# EAGLE design tltest (EAGLE 5.12)
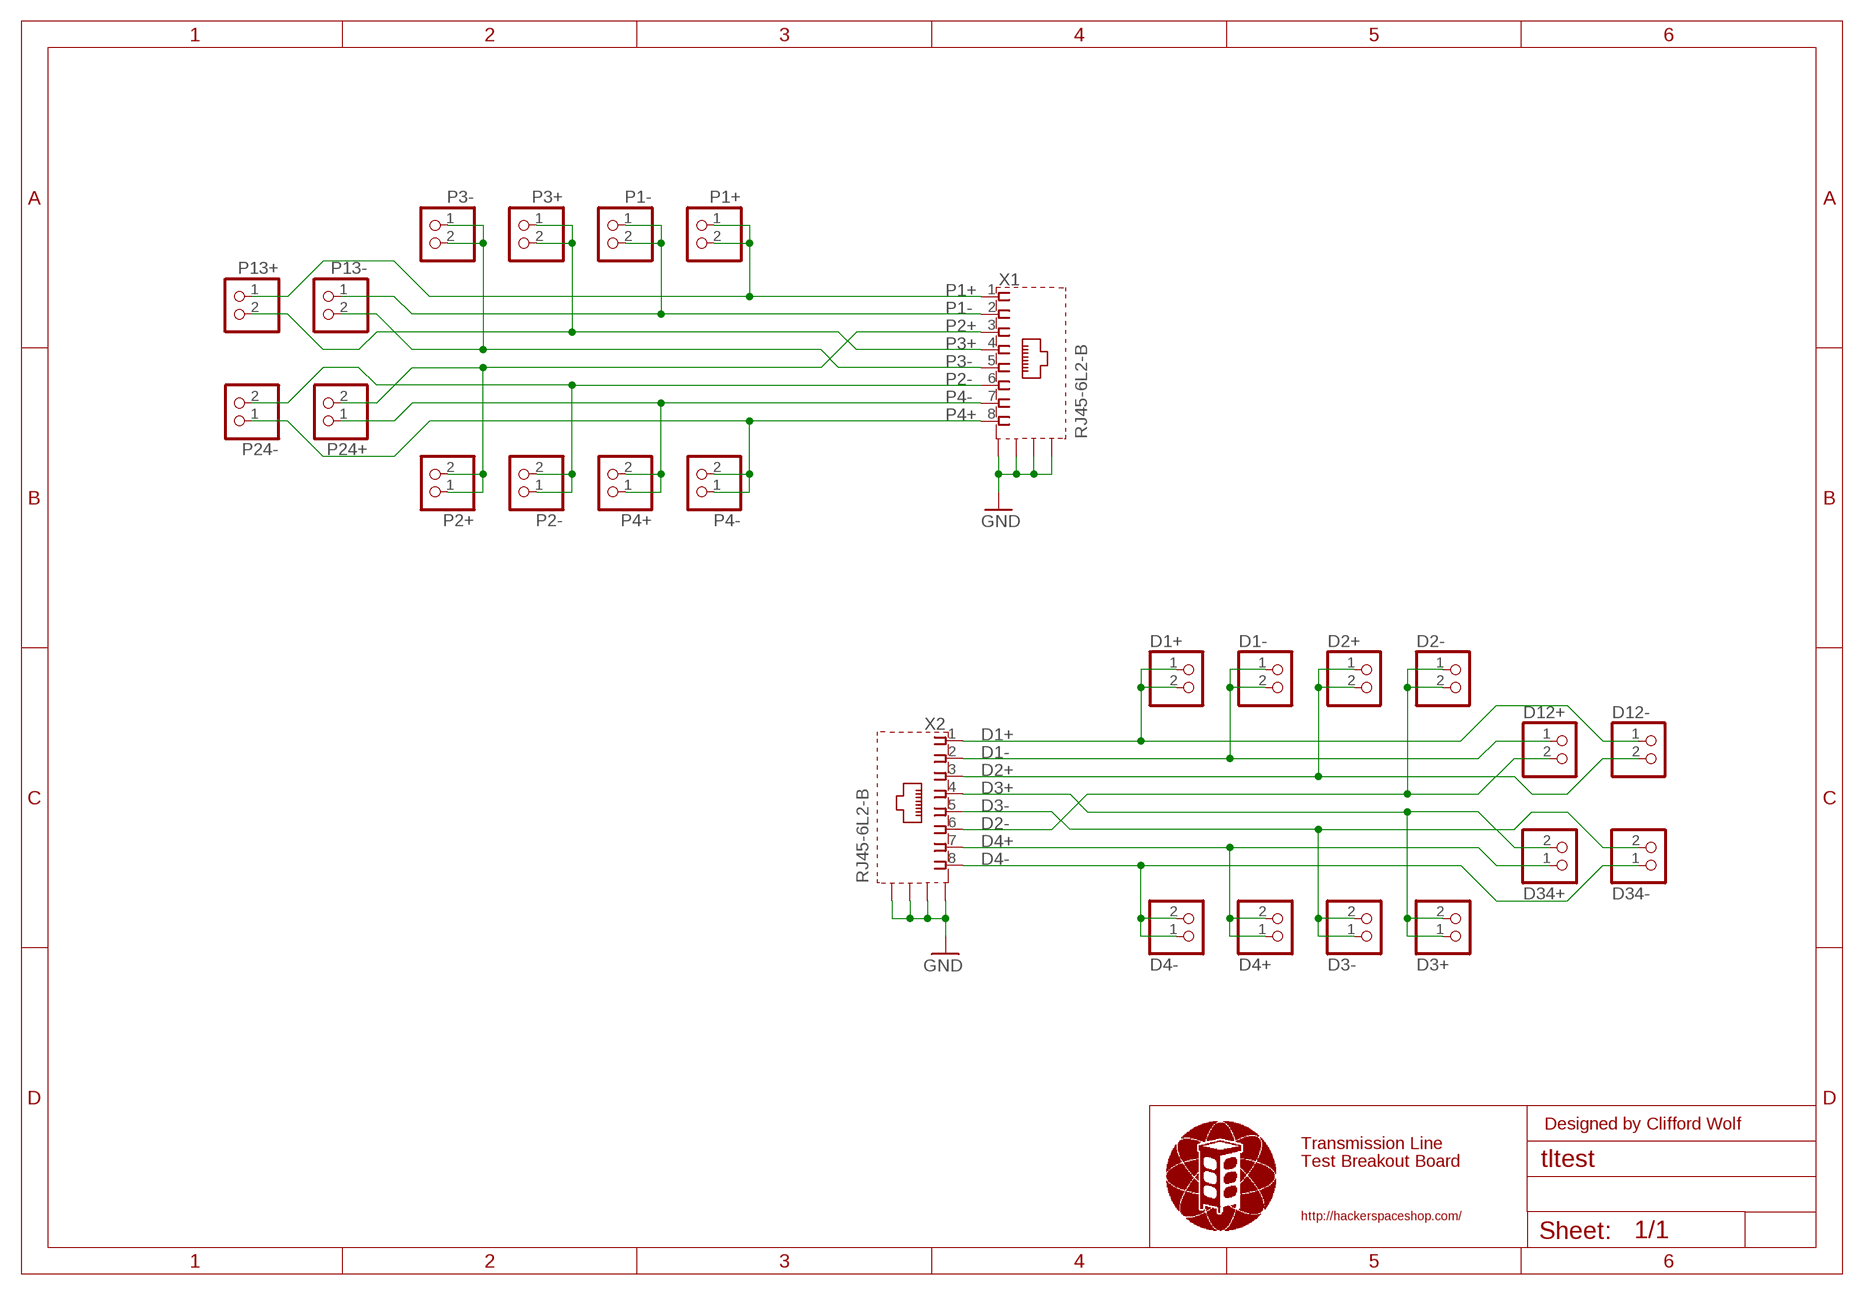
[diagram p0: schematic, sheet 1]

## Parts
D1+  PINHD-1X2  [1X02]
D1-  PINHD-1X2  [1X02]
D2+  PINHD-1X2  [1X02]
D2-  PINHD-1X2  [1X02]
D3+  PINHD-1X2  [1X02]
D3-  PINHD-1X2  [1X02]
D4+  PINHD-1X2  [1X02]
D4-  PINHD-1X2  [1X02]
D12+  PINHD-1X2  [1X02]
D12-  PINHD-1X2  [1X02]
D34+  PINHD-1X2  [1X02]
D34-  PINHD-1X2  [1X02]
P1+  PINHD-1X2  [1X02]
P1-  PINHD-1X2  [1X02]
P2+  PINHD-1X2  [1X02]
P2-  PINHD-1X2  [1X02]
P3+  PINHD-1X2  [1X02]
P3-  PINHD-1X2  [1X02]
P4+  PINHD-1X2  [1X02]
P4-  PINHD-1X2  [1X02]
P13+  PINHD-1X2  [1X02]
P13-  PINHD-1X2  [1X02]
P24+  PINHD-1X2  [1X02]
P24-  PINHD-1X2  [1X02]
X1  RJ45-6L2-B  [RJ45-SHIELD2]
X2  RJ45-6L2-B  [RJ45-SHIELD2]

## Nets
D1+: D1+.1 D1+.2 D12-.1 X2.1
D1-: D1-.1 D1-.2 D12+.1 X2.2
D2+: D2+.1 D2+.2 D12-.2 X2.3
D2-: D2-.1 D2-.2 D12+.2 X2.6
D3+: D3+.1 D3+.2 D34+.2 X2.4
D3-: D3-.1 D3-.2 D34-.2 X2.5
D4+: D4+.1 D4+.2 D34+.1 X2.7
D4-: D4-.1 D4-.2 D34-.1 X2.8
GND: X1.S1(S) X1.S2(S) X1.S3(S) X1.S4(S) X2.S1(S) X2.S2(S) X2.S3(S) X2.S4(S)
P1+: P1+.1 P1+.2 P13+.1 X1.1
P1-: P1-.1 P1-.2 P13-.1 X1.2
P2+: P2+.1 P2+.2 P24+.2 X1.3
P2-: P2-.1 P2-.2 P24-.2 X1.6
P3+: P3+.1 P3+.2 P13+.2 X1.4
P3-: P3-.1 P3-.2 P13-.2 X1.5
P4+: P4-.1 P4-.2 P24-.1 X1.8
P4-: P4+.1 P4+.2 P24+.1 X1.7

## Notes on the sheet
- Designed by Clifford Wolf
- Transmission Line
- Test Breakout Board
- http://hackerspaceshop.com/

## Library data of the parts
D1+ D1- D2+ D2- D3+ D3- D4+ D4- D12+ D12- D34+ D34- P1+ P1- P2+ P2- P3+ P3- P4+ P4- P13+ P13- P24+ P24- = mpc_pinhead:PINHD-1X2: PIN HEADER
X1 X2 = con-tycoelectronics:RJ45*2: RJ45 Low Profile Shield Type 2 For all RJ45 L, LC, LCT and X Series Models Source: www.tycoelectronics.com .. ENG_DS_1654001_1099_RJ_L_0507.pdf; MPN: RJ45-6L2-B; OC_FARNELL: unknown; OC_NEWARK: 16R6096

## Board
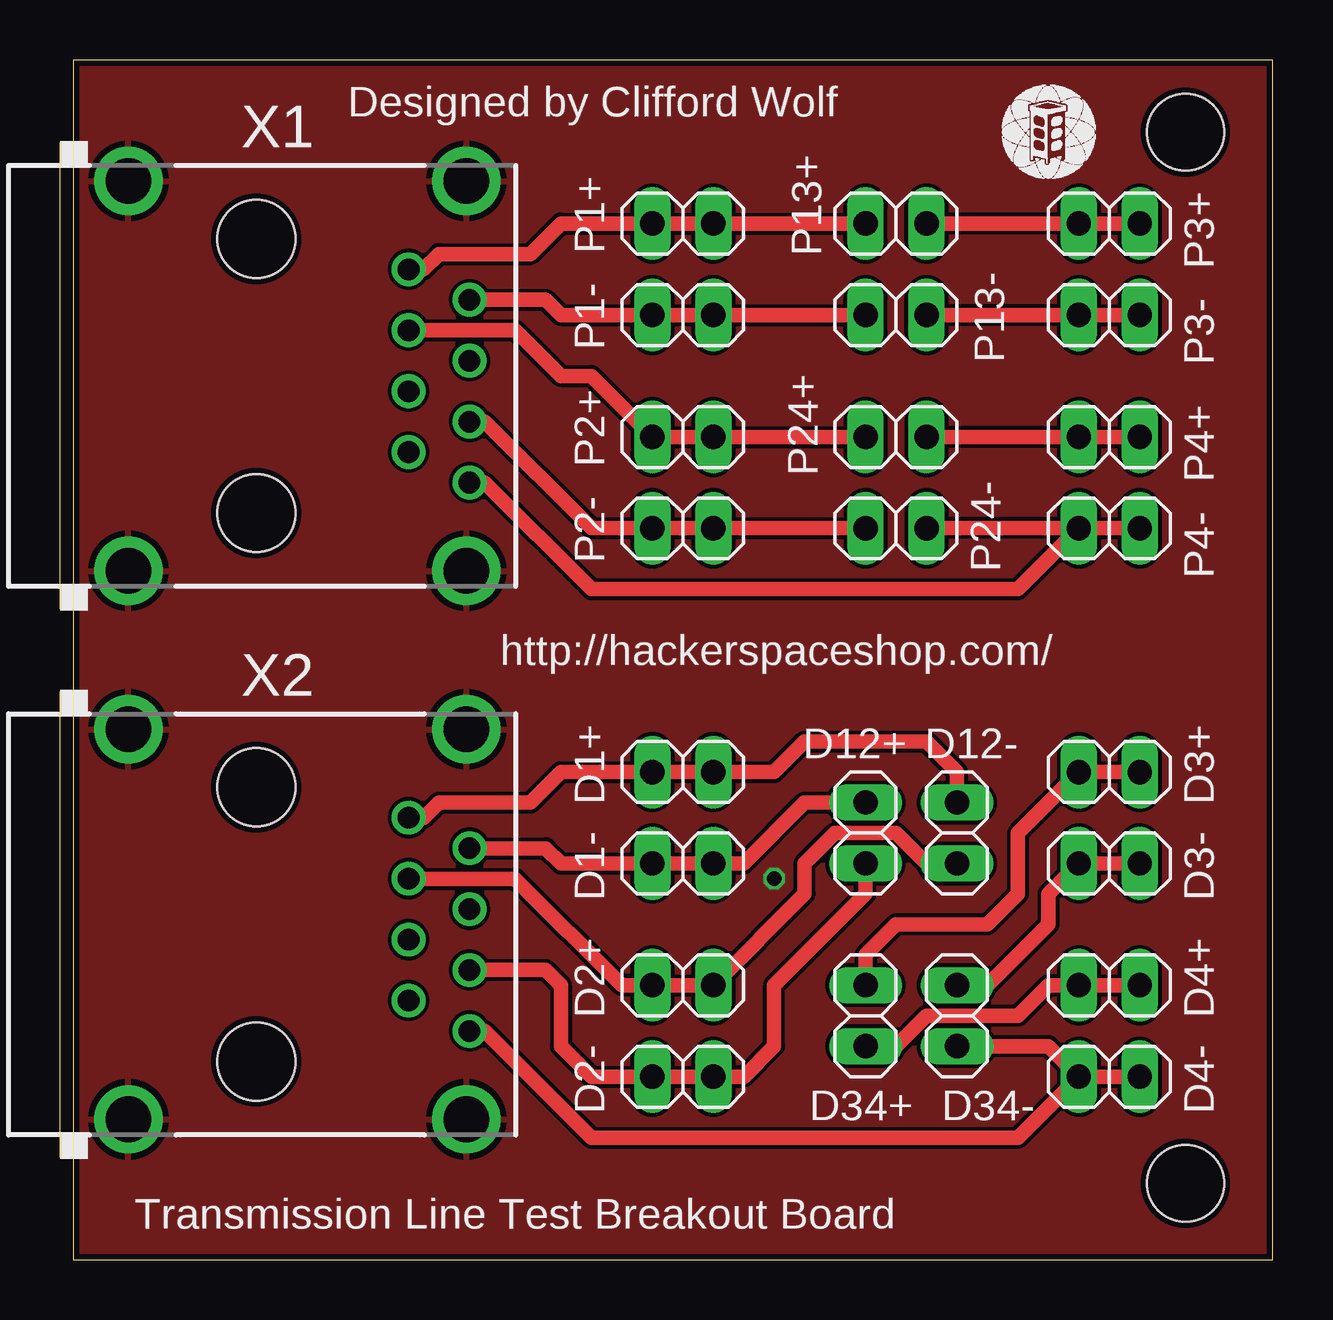
[diagram p1: board, top side]
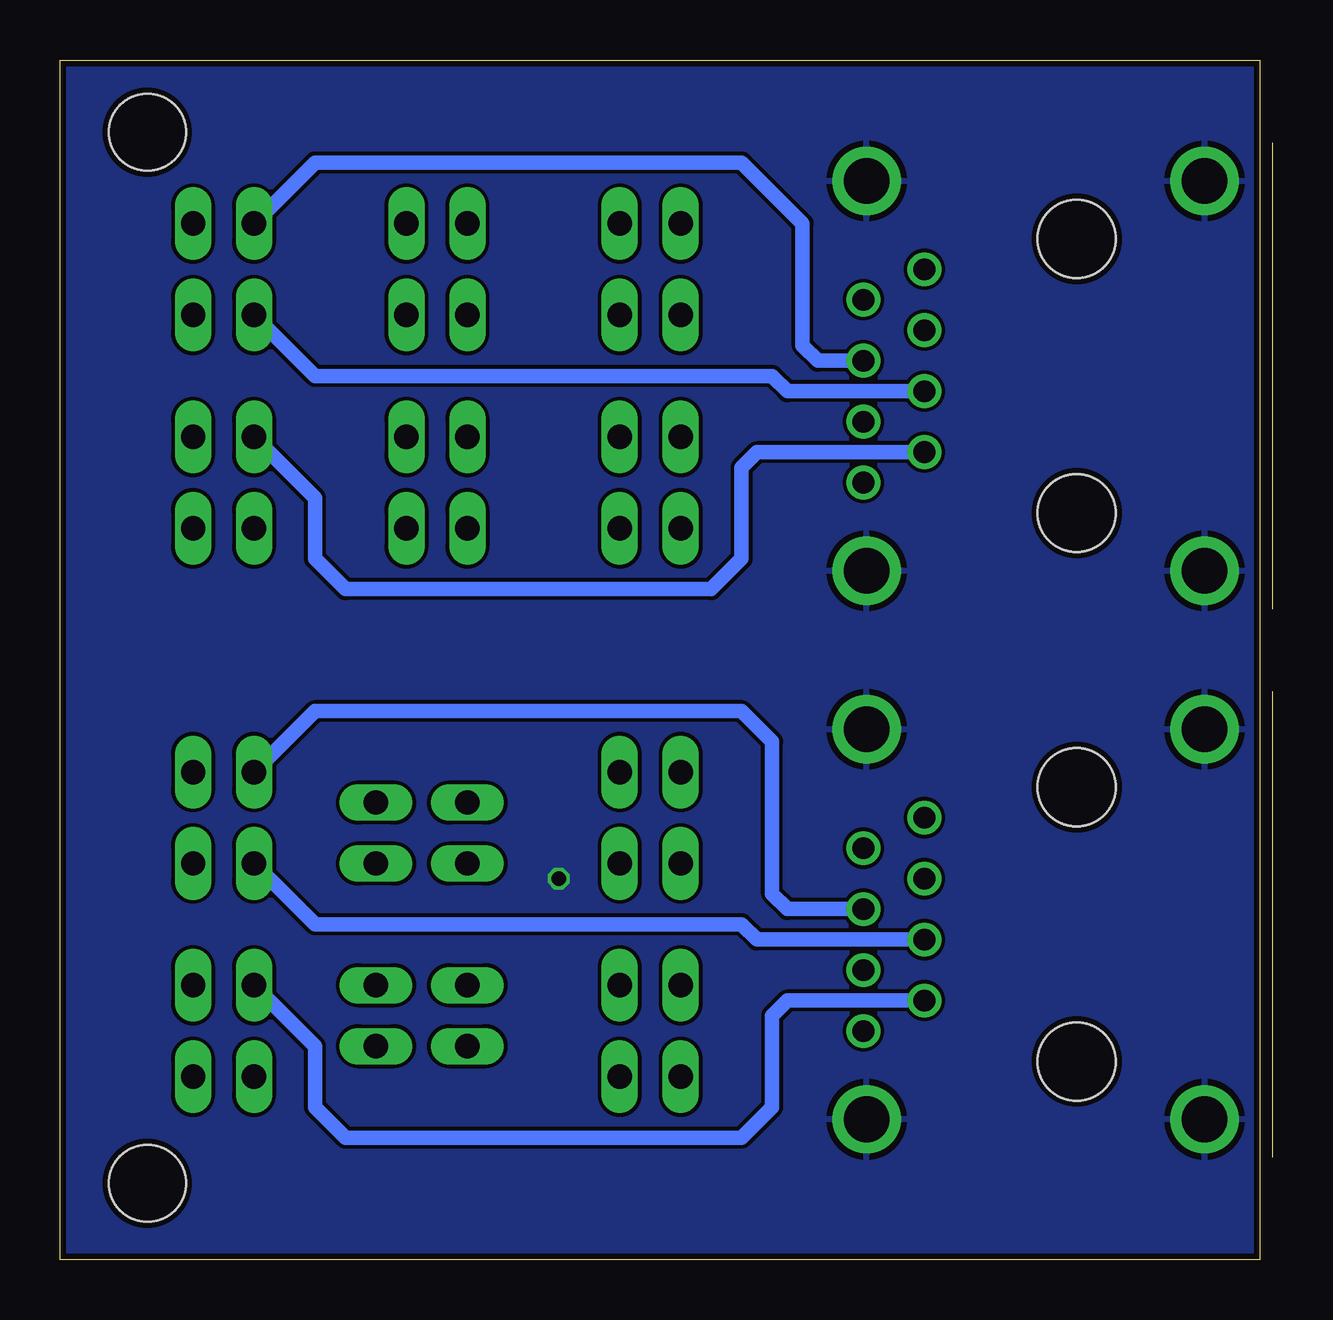
[diagram p2: board, bottom side, seen from below]

Size 50 x 50 mm. Coordinates in mm from the lower left corner, seen from the top.
Outline: 0,0 50,0 50,50 0,50 0,0
Copper layers (1*16): Top 0.035mm / dielectric 1.5mm / Bottom 0.035mm
Design rules "seeed": minimum track width 6mil, minimum drill 12mil, track to track 6mil, track to pad 6mil, pad to pad 6mil, via to via 6mil, smd to smd 0mil, copper to edge 10mil, drill to drill 10mil, minimum pad ring 10mil, minimum via ring 6mil, stop-mask expansion 2mil, vias tented up to drill 100mil, thermal gap 10mil
Holes 3.2 mm at 46.35,46.99 46.35,3.17

### Footprints (pad centres in the part's own frame; a part is rotated, then mirrored left to right if it is on the bottom)
1X02 = drill 1.016 long: 1 -1.27,0; 2 1.27,0
RJ45-SHIELD2 = drill 0.9 pad 1.4 round: 1 -4.445,6.35; 2 -3.175,8.89; 3 -1.905,6.35; 4 -0.635,8.89; 5 0.635,6.35; 6 1.905,8.89; 7 3.175,6.35; 8 4.445,8.89 | drill 1.9 pad 2.5 round: S1 -8.128,-5.33; S2 8.128,-5.33; S3 -8.128,8.76; S4 8.128,8.76 | hole 3.251: -5.715,0; 5.715,0

### Placement (x,y rotation side)
D1+  25.4,20.32 180 top
D1-  25.4,16.51 180 top
D2+  25.4,11.43 180 top
D2-  25.4,7.62 180 top
D3+  43.18,20.32 180 top
D3-  43.18,16.51 180 top
D4+  43.18,11.43 180 top
D4-  43.18,7.62 180 top
D12+  33.02,17.78 270 top
D12-  36.83,17.78 270 top
D34+  33.02,10.16 90 top
D34-  36.83,10.16 90 top
P1+  25.4,43.18 180 top
P1-  25.4,39.37 180 top
P2+  25.4,34.29 180 top
P2-  25.4,30.48 180 top
P3+  43.18,43.18 180 top
P3-  43.18,39.37 180 top
P4+  43.18,34.29 180 top
P4-  43.18,30.48 180 top
P13+  34.29,43.18 0 top
P13-  34.29,39.37 0 top
P24+  34.29,34.29 180 top
P24-  34.29,30.48 180 top
U$1  [METALAB_SMALL]  40.64,46.99 0 top
X1  7.62,36.83 270 top
X2  7.62,13.97 270 top

### Tracks (layer width: path | path; a pad name or v marks a point on that pad's centre or on a via)
D1+
  Top 0.61: X2.1 14.61,18.41 15.24,19.05 19.05,19.05 20.32,20.32 D1+.2 D1+.1 29.21,20.32 30.48,21.59 35.56,21.59 36.83,20.32 D12-.1
D1-
  Top 0.61: X2.2 19.68,17.14 20.32,16.51 D1-.2 D1-.1 27.94,16.51 30.48,19.05 D12+.1
D2+
  Top 0.61: X2.3 18.41,15.88 22.86,11.43 D2+.2 D2+.1 30.48,15.24 30.48,16.51 31.75,17.78 34.29,17.78 35.56,16.51 D12-.2
D2-
  Top 0.61: X2.6 19.68,12.06 20.32,11.43 20.32,8.89 21.59,7.62 D2-.2 D2-.1 27.94,7.62 29.21,8.89 29.21,11.43 33.02,15.24 D12+.2
D3+
  Top 0.61: D3+.1 D3+.2 39.37,17.78 39.37,15.24 38.1,13.97 34.29,13.97 33.02,12.7 D34+.2
  Bottom 0.61: X2.4 19.68,14.61 20.32,15.24 20.32,21.59 21.59,22.86 39.37,22.86 D3+.2
D3-
  Top 0.61: D3-.1 D3-.2 40.64,15.24 40.64,13.97 38.1,11.43 D34-.2
  Bottom 0.61: X2.5 20.95,13.34 21.59,13.97 39.37,13.97 D3-.2
D4+
  Top 0.61: D4+.1 D4+.2 40.64,11.43 39.37,10.16 35.56,10.16 34.29,8.89 D34+.1
  Bottom 0.61: X2.7 19.68,10.79 20.32,10.16 20.32,6.35 21.59,5.08 38.1,5.08 39.37,6.35 39.37,8.89 D4+.2
D4-
  Top 0.61: X2.8 17.14,9.53 21.59,5.08 39.37,5.08 D4-.2 | D4-.2 D4-.1 | D34-.1 40.64,8.89 D4-.2
GND  (via drill 0.6)
  other vias: 29.21,15.88
  pour Bottom: 0,0 0,50 50,50 50,0
  pour Top: 0,0 0,50 50,50 50,0
P1+
  Top 0.61: X1.1 14.61,41.27 15.24,41.91 19.05,41.91 20.32,43.18 P1+.2 P1+.1 P13+.1
P1-
  Top 0.61: X1.2 19.68,40.01 20.32,39.37 P1-.2 P1-.1 P13-.1
P2+
  Top 0.61: X1.3 18.41,38.73 20.32,36.83 21.59,36.83 P2+.2 P2+.1 P24+.2
P2-
  Top 0.61: X1.6 17.14,34.92 21.59,30.48 P2-.2 P2-.1 P24-.2
P3+
  Top 0.61: P13+.2 P3+.2 P3+.1
  Bottom 0.61: X1.4 18.41,37.47 19.05,38.1 19.05,43.18 21.59,45.72 39.37,45.72 P3+.2
P3-
  Top 0.61: P13-.2 P3-.2 P3-.1
  Bottom 0.61: X1.5 19.68,36.2 20.32,36.83 39.37,36.83 P3-.2
P4+
  Top 0.61: X1.8 17.14,32.38 21.59,27.94 39.37,27.94 P4-.2 | P4-.2 P24-.1 | P4-.2 P4-.1
P4-
  Top 0.61: P24+.1 P4+.2 P4+.1
  Bottom 0.61: X1.7 20.95,33.66 21.59,33.02 21.59,29.21 22.86,27.94 38.1,27.94 39.37,29.21 39.37,31.75 P4+.2

### Text on the board
tPlace: Designed by Clifford Wolf | http://hackerspaceshop.com/ | Transmission Line Test Breakout Board